# EAGLE design MLX81310EVB_BoardHolder (EAGLE 6.4)

## Sheet 1 of 2
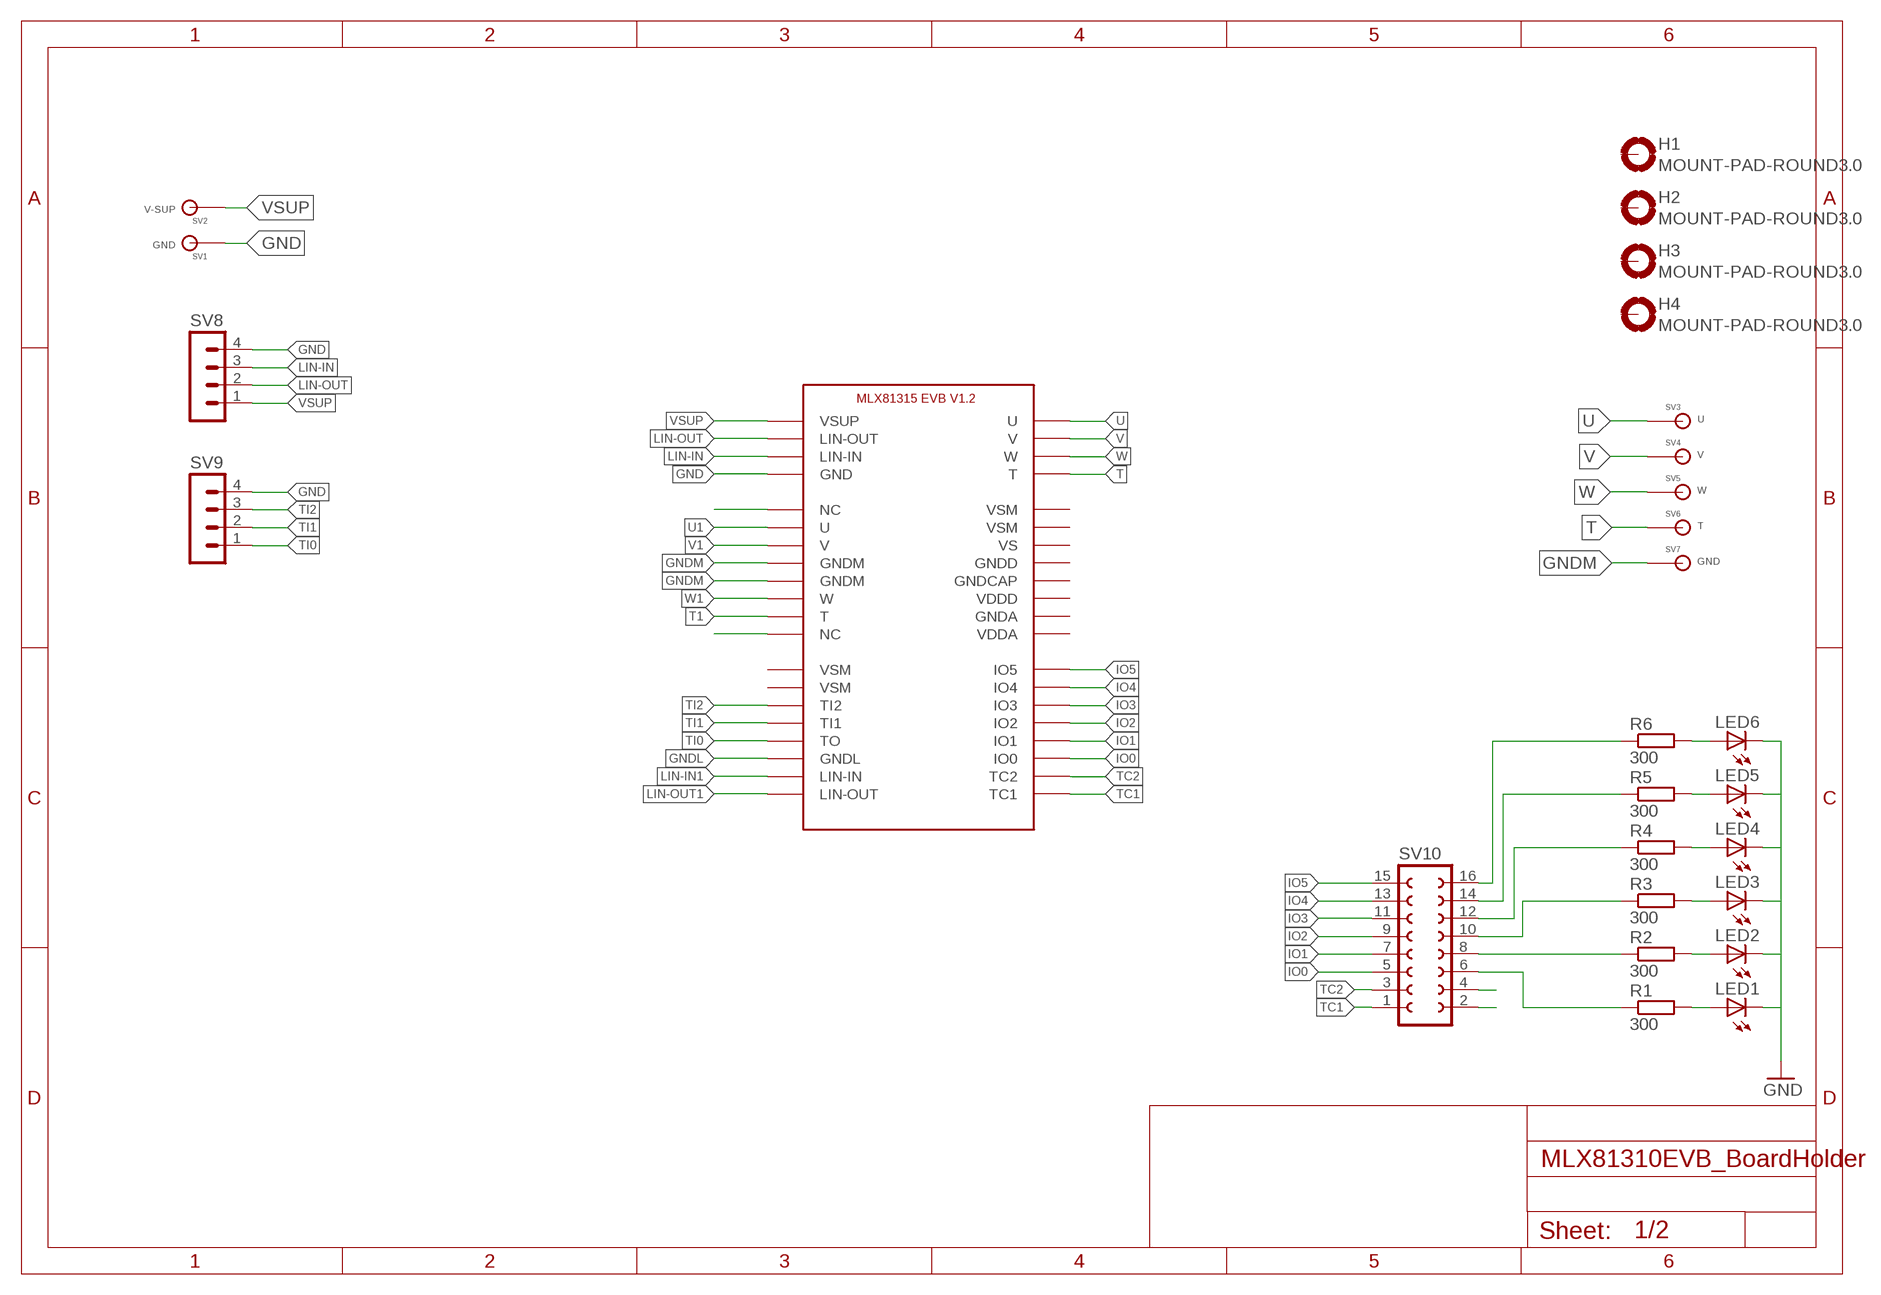
[diagram p0: schematic, sheet 1]

### Parts
B1  MLX91315_EVB  [MLX81315EVB]
H1  MOUNT-PAD-ROUND3.0  [3,0-PAD]
H2  MOUNT-PAD-ROUND3.0  [3,0-PAD]
H3  MOUNT-PAD-ROUND3.0  [3,0-PAD]
H4  MOUNT-PAD-ROUND3.0  [3,0-PAD]
LED1  LEDCHIPLED_0805  [CHIPLED_0805]
LED2  LEDCHIPLED_0805  [CHIPLED_0805]
LED3  LEDCHIPLED_0805  [CHIPLED_0805]
LED4  LEDCHIPLED_0805  [CHIPLED_0805]
LED5  LEDCHIPLED_0805  [CHIPLED_0805]
LED6  LEDCHIPLED_0805  [CHIPLED_0805]
R1  300  R-EU_M0805  [M0805]
R2  300  R-EU_M0805  [M0805]
R3  300  R-EU_M0805  [M0805]
R4  300  R-EU_M0805  [M0805]
R5  300  R-EU_M0805  [M0805]
R6  300  R-EU_M0805  [M0805]
SV1  GND  BANANNA_CONNECTOR_SOLDER_4MM  [BANANNA_CONNECTOR_SOLIDER_4MM]
SV2  V-SUP  BANANNA_CONNECTOR_SOLDER_4MM  [BANANNA_CONNECTOR_SOLIDER_4MM]
SV3  U  BANANNA_CONNECTOR_SOLDER_4MM  [BANANNA_CONNECTOR_SOLIDER_4MM]
SV4  V  BANANNA_CONNECTOR_SOLDER_4MM  [BANANNA_CONNECTOR_SOLIDER_4MM]
SV5  W  BANANNA_CONNECTOR_SOLDER_4MM  [BANANNA_CONNECTOR_SOLIDER_4MM]
SV6  T  BANANNA_CONNECTOR_SOLDER_4MM  [BANANNA_CONNECTOR_SOLIDER_4MM]
SV7  GND  BANANNA_CONNECTOR_SOLDER_4MM  [BANANNA_CONNECTOR_SOLIDER_4MM]
SV8  MA04-1  [MA04-1]
SV9  MA04-1  [MA04-1]
SV10  FE08-2  [FE08-2]

### Nets
GND: B1.GND@1(GND) LED1.C LED2.C LED3.C LED4.C LED5.C LED6.C SV1.P$1 SV8.4 SV9.4
GNDL: B1.GNDL
GNDM: B1.GNDM@1(GNDM) B1.GNDM@2(GNDM) SV7.P$1
IO0: B1.IO0 SV10.5
IO1: B1.IO1 SV10.7
IO2: B1.IO2 SV10.9
IO3: B1.IO3 SV10.11
IO4: B1.IO4 SV10.13
IO5: B1.IO5 SV10.15
LIN-IN: B1.LIN-IN@1(LIN-IN) SV8.3
LIN-IN1: B1.LIN-IN@2(LIN-IN)
LIN-OUT: B1.LIN-OUT@1(LIN-OUT) SV8.2
LIN-OUT1: B1.LIN-OUT@2(LIN-OUT)
N$1: R6.1 SV10.16
N$2: R4.1 SV10.12
N$3: R1.1 SV10.6
N$4: R2.1 SV10.8
N$5: LED1.A R1.2
N$6: R3.1 SV10.10
N$7: R5.1 SV10.14
N$8: LED6.A R6.2
N$9: LED5.A R5.2
N$10: LED4.A R4.2
N$11: B1.NC$1(NC)
N$12: LED3.A R3.2
N$13: LED2.A R2.2
N$18: B1.NC@8(NC)
T: B1.T@1(T) SV6.P$1
T1: B1.T@2(T)
TC1: B1.TC1 SV10.1 SV10.2
TC2: B1.TC2 SV10.3 SV10.4
TI0: B1.T0(TO) SV9.1
TI1: B1.TI1 SV9.2
TI2: B1.TI2 SV9.3
U: B1.U@1(U) SV3.P$1
U1: B1.U@2(U)
V: B1.V@1(V) SV4.P$1
V1: B1.V@2(V)
VSUP: B1.VSUP SV2.P$1 SV8.1
W: B1.W@1(W) SV5.P$1
W1: B1.W@2(W)
Unconnected: B1.GNDA B1.GNDCAP B1.GNDD B1.VDDA B1.VDDD B1.VS B1.VSM$1(VSM) B1.VSM$2(VSM) B1.VSM@1(VSM) B1.VSM@2(VSM) H1.B3,0(MOUNT) H2.B3,0(MOUNT) H3.B3,0(MOUNT) H4.B3,0(MOUNT)

## Sheet 2 of 2
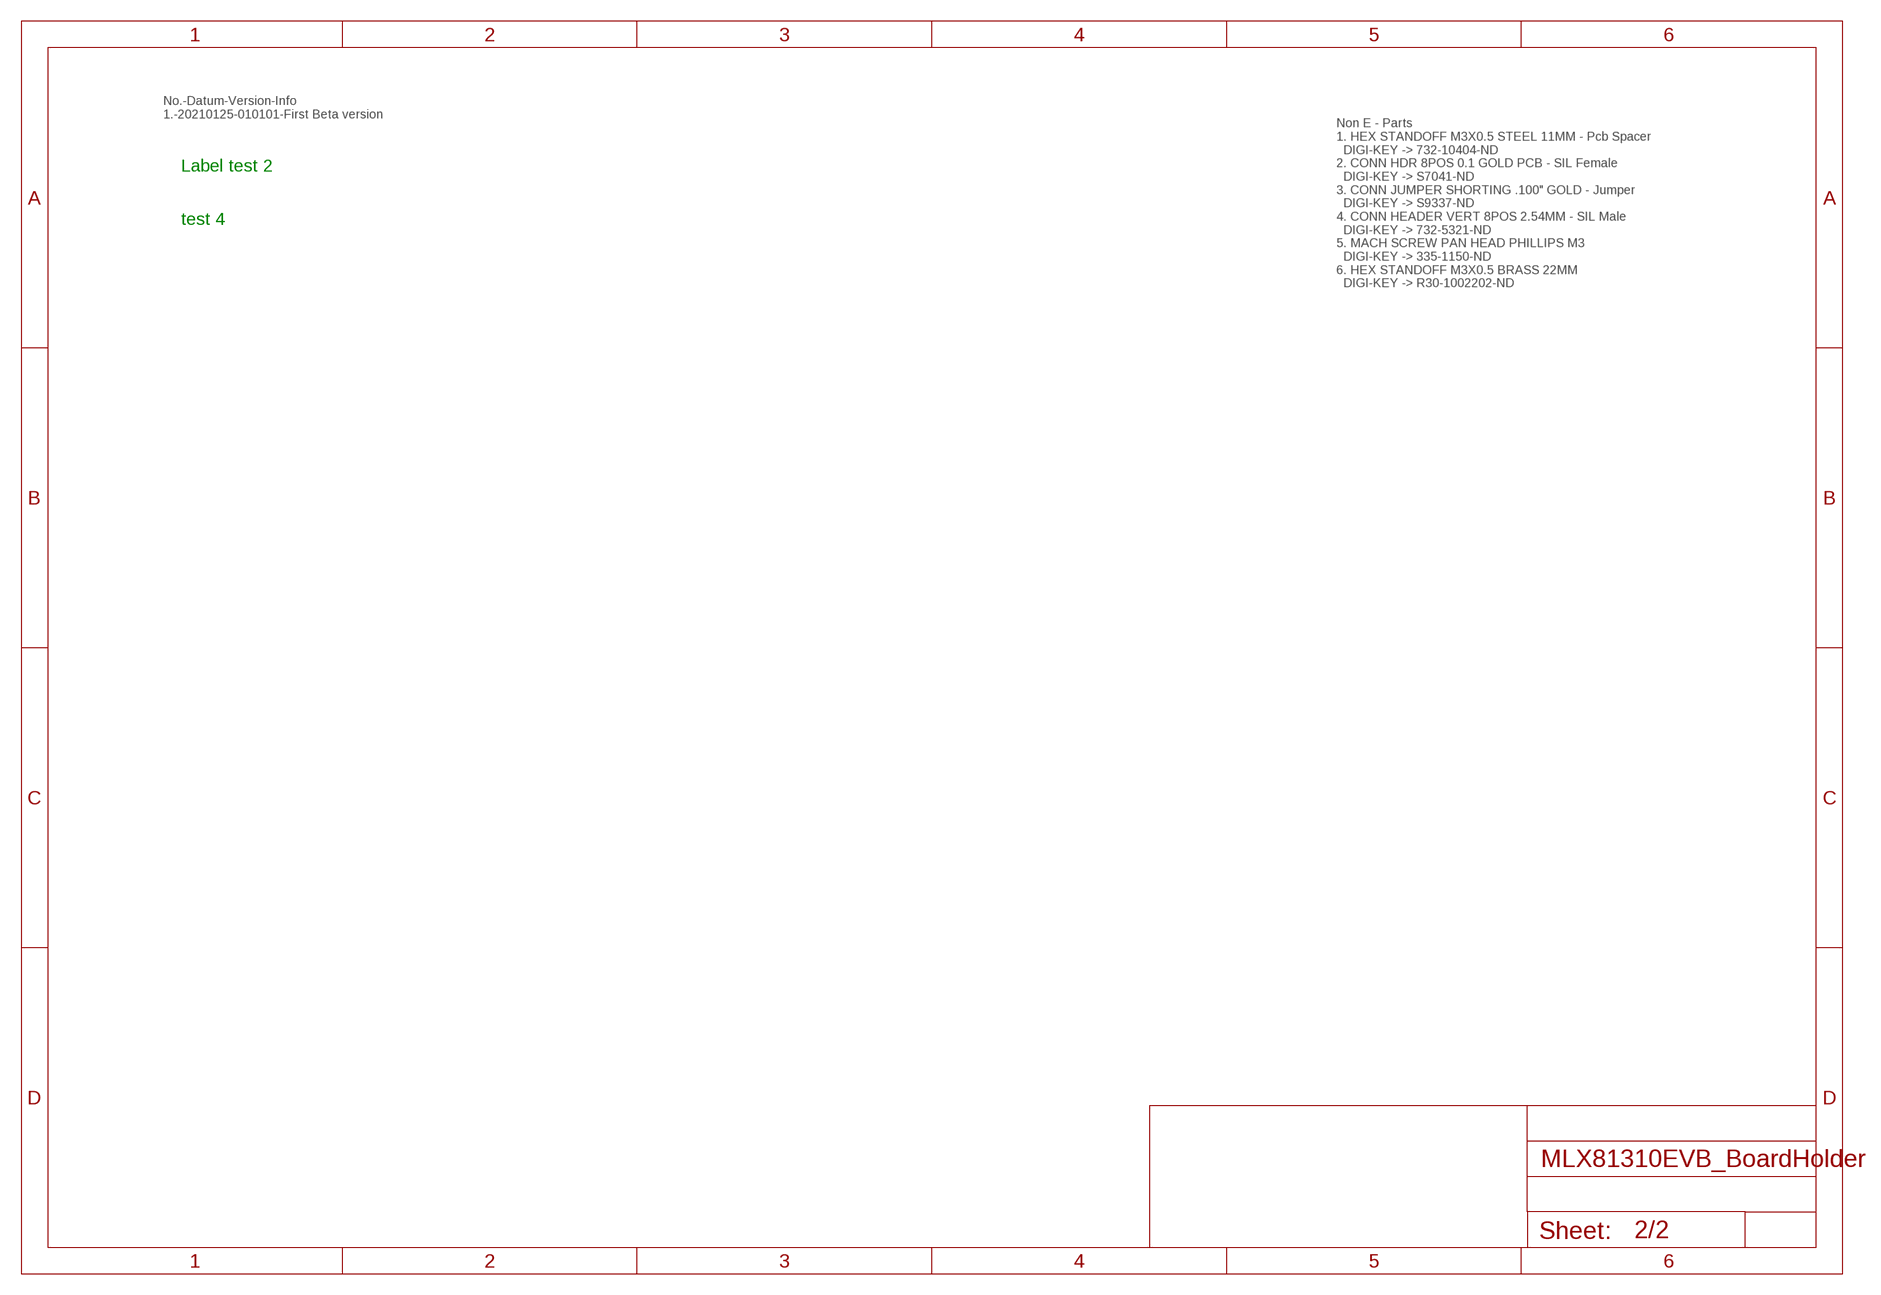
[diagram p1: schematic, sheet 2]

### Notes on the sheet
- No.-Datum-Version-Info	
  1.-20210125-010101-First Beta version
- Non E - Parts 
  1. HEX STANDOFF M3X0.5 STEEL 11MM - Pcb Spacer
    DIGI-KEY -> 732-10404-ND
  2. CONN HDR 8POS 0.1 GOLD PCB - SIL Female
    DIGI-KEY -> S7041-ND
  3. CONN JUMPER SHORTING .100" GOLD - Jumper
    DIGI-KEY -> S9337-ND
  4. CONN HEADER VERT 8POS 2.54MM - SIL Male
    DIGI-KEY -> 732-5321-ND
  5. MACH SCREW PAN HEAD PHILLIPS M3
    DIGI-KEY -> 335-1150-ND
  6. HEX STANDOFF M3X0.5 BRASS 22MM
    DIGI-KEY -> R30-1002202-ND
- Label test 2
- test 4

## Library data of the parts
B1 = MLX81315EVB:MLX91315_EVB: MLX81310EVB_V1.3
H1-H4 = holes:MOUNT-PAD-ROUND: MOUNTING PAD, round
LED1-LED6 = led:LED: LED OSRAM: - CHIPLED LG R971, LG N971, LY N971, LG Q971, LY Q971, LO R971, LY R971 LH N974, LH R974 LS Q976, LO Q976, LY Q976 LO Q996 - Hyper CHIPLED LW Q18S LB Q993, LB Q99A, LB R99A - SideLED LS A670, LO A670, LY A670, LG A670, LP A670 LB A673, LV A673, LT A673, LW A673 LH A674 LY A675 LS A676, LA A676, LO A676, LY A676, LW A676 LS A679, LY A679, LG A679 - Hyper Micro SIDELED® LS Y876, LA Y876, LO Y876, LY Y876 LT Y87S - SmartLED LW L88C, LW L88S LB L89C, LB L89S, LG L890 LS L89K, LO L89K, LY L89K LS L896, LA L896, LO L896, LY L896 - TOPLED LS T670, LO T670, LY T670, LG T670, LP T670 LSG T670, LSP T670, LSY T670, LOP T670, LYG T670 LG T671, LOG T671, LSG T671 LB T673, LV T673, LT T673, LW T673 LH T674 LS T676, LA T676, LO T676, LY T676, LB T676, LH T676, LSB T676, LW T676 LB T67C, LV T67C, LT T67C, LS T67K, LO T67K, LY T67K, LW E67C LS E67B, LA E67B, LO E67B, LY E67B, LB E67C, LV E67C, LT E67C LW T67C LS T679, LY T679, LG T679 LS T770, LO T770, LY T770, LG T770, LP T770 LB T773, LV T773, LT T773, LW T773 LH T774 LS E675, LA E675, LY E675, LS T675 LS T776, LA T776, LO T776, LY T776, LB T776 LHGB T686 LT T68C, LB T68C - Hyper Mini TOPLED® LB M676 - Mini TOPLED Santana® LG M470 LS M47K, LO M47K, LY M47K Source: http://www.osram.convergy.de LUXEON: - LUMILED® LXK2-PW12-R00, LXK2-PW12-S00, LXK2-PW14-U00, LXK2-PW14-V00 LXK2-PM12-R00, LXK2-PM12-S00, LXK2-PM14-U00 LXK2-PE12-Q00, LXK2-PE12-R00, LXK2-PE12-S00, LXK2-PE14-T00, LXK2-PE14-U00 LXK2-PB12-K00, LXK2-PB12-L00, LXK2-PB12-M00, LXK2-PB14-N00, LXK2-PB14-P00, LXK2-PB14-Q00 LXK2-PR12-L00, LXK2-PR12-M00, LXK2-PR14-Q00, LXK2-PR14-R00 LXK2-PD12-Q00, LXK2-PD12-R00, LXK2-PD12-S00 LXK2-PH12-R00, LXK2-PH12-S00 LXK2-PL12-P00, LXK2-PL12-Q00, LXK2-PL12-R00 Source: www.luxeon.com KINGBRIGHT: KA-3528ASYC Source: www.kingbright.com; DIGI-KEY: 160-1218-1-ND
R1-R6 = resistor:R-EU_: RESISTOR, European symbol; DIGI-KEY: RR12P300DCT-ND
SV1-SV7 = EagleLib:BANANNA_CONNECTOR_SOLDER_4MM: Bananensteckerbuchse Connector Standard-Bananenstecker Lötverbindung; DIGI-KEY: 36-575-4-ND
SV8 SV9 = con-lstb:MA04-1: PIN HEADER; DIGI-KEY: 732-5317-ND; OC_FARNELL: unknown; OC_NEWARK: unknown
SV10 = con-lsta:FE08-2: FEMALE HEADER; DIGI-KEY: 609-3364-ND; OC_FARNELL: unknown; OC_NEWARK: unknown

## Board
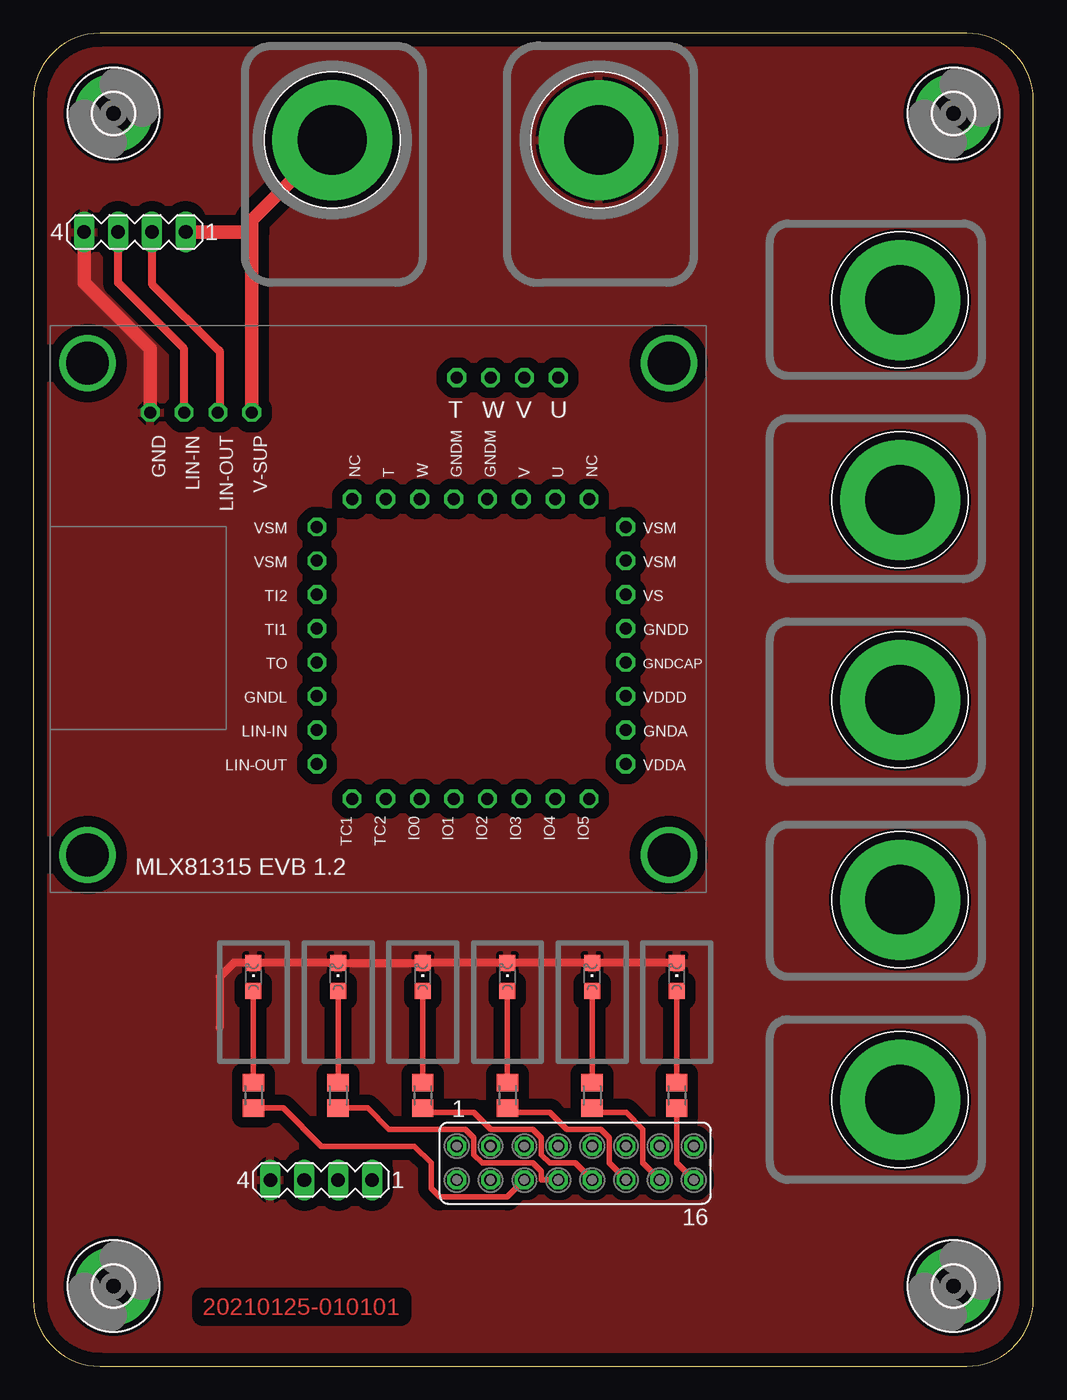
[diagram p2: board, top side]
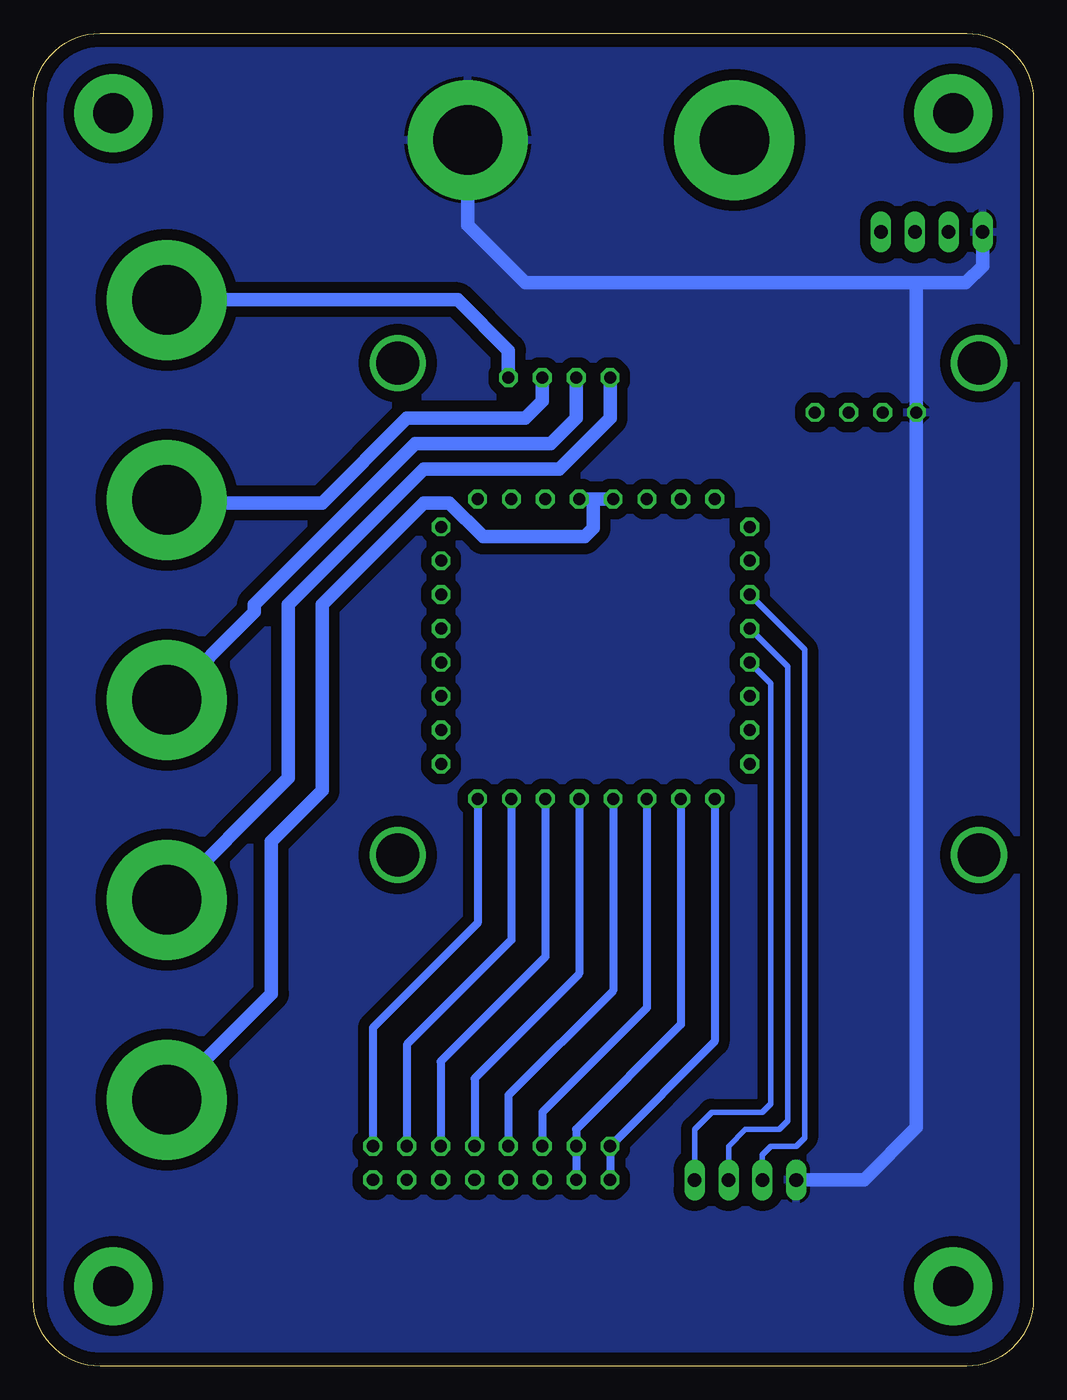
[diagram p3: board, bottom side, seen from below]

Size 75 x 100 mm. Coordinates in mm from the lower left corner, seen from the top.
Outline: 0,95 0,5 arc90 5,0 70,0 arc90 75,5 75,95 arc90 70,100 5,100 arc90 0,95
Copper layers (1*16): Top 0.035mm / dielectric 1.5mm / Bottom 0.035mm
Design rules "default": minimum track width 10mil, minimum drill 24mil, track to track 8mil, track to pad 8mil, pad to pad 8mil, via to via 8mil, smd to smd 8mil, copper to edge 40mil, drill to drill 8mil, minimum pad ring 10mil, minimum via ring 8mil, stop-mask expansion 4mil, vias tented up to drill 0mil, thermal gap 10mil

### Footprints (pad centres in the part's own frame; a part is rotated, then mirrored left to right if it is on the bottom)
MLX81315EVB = drill 0.9 octagon: GND@1 7.493,36; GNDA 43.155,12.167; GNDCAP 43.155,17.247; GNDD 43.155,19.787; GNDL 20,14.707; GNDM@1 32.791,29.5; GNDM@2 30.251,29.5; IO0 27.711,7.01; IO1 30.251,7.01; IO2 32.791,7.01; IO3 35.331,7.01; IO4 37.871,7.01; IO5 40.411,7.01; LIN-IN@1 10.033,36; LIN-IN@2 20,12.167; LIN-OUT@1 12.573,36; LIN-OUT@2 20,9.627; NC$1 40.411,29.5; NC@8 22.631,29.5; T0 20,17.247; T@1 30.48,38.608; T@2 25.171,29.5; TC1 22.631,7.01; TC2 25.171,7.01; TI1 20,19.787; TI2 20,22.327; U@1 38.1,38.608; U@2 37.871,29.5; V@1 35.56,38.608; V@2 35.331,29.5; VDDA 43.155,9.627; VDDD 43.155,14.707; VS 43.155,22.327; VSM$1 20,27.407; VSM$2 20,24.867; VSM@1 43.155,24.867; VSM@2 43.155,27.407; VSUP 15.113,36; W@1 33.02,38.608; W@2 27.711,29.5 | drill 3.2: P$1 2.8,2.8; P$2 46.4,2.8; P$3 46.4,39.7; P$4 2.8,39.7
3,0-PAD = drill 3 pad 5.842: B3,0 0,0
CHIPLED_0805 = smd 1.2 x 1.2: A 0,-1.05; C 0,1.05
M0805 = smd 1.3 x 1.6: 1 -0.95,0; 2 0.95,0
BANANNA_CONNECTOR_SOLIDER_4MM = drill 5.2 pad 9: P$1 0,0
MA04-1 = drill 1.016 long: 1 -3.81,0; 2 -1.27,0; 3 1.27,0; 4 3.81,0
FE08-2 = drill 0.914 octagon: 1 -8.89,1.27; 2 -8.89,-1.27; 3 -6.35,1.27; 4 -6.35,-1.27; 5 -3.81,1.27; 6 -3.81,-1.27; 7 -1.27,1.27; 8 -1.27,-1.27; 9 1.27,1.27; 10 1.27,-1.27; 11 3.81,1.27; 12 3.81,-1.27; 13 6.35,1.27; 14 6.35,-1.27; 15 8.89,1.27; 16 8.89,-1.27

### Placement (x,y rotation side)
B1  1.27,35.56 0 top
H1  69,6 0 top
H2  69,94 0 top
H3  6,6 0 top
H4  6,94 0 top
LED1  16.51,29.21 0 top
LED2  22.86,29.21 0 top
LED3  29.21,29.21 0 top
LED4  35.56,29.21 0 top
LED5  41.91,29.21 0 top
LED6  48.26,29.21 0 top
R1  16.51,20.32 90 top
R2  22.86,20.32 90 top
R3  29.21,20.32 90 top
R4  35.56,20.32 90 top
R5  41.91,20.32 90 top
R6  48.26,20.32 90 top
SV1  42.42,92 0 top
SV2  22.42,92 0 top
SV3  65,80 0 top
SV4  65,65 0 top
SV5  65,50 0 top
SV6  65,35 0 top
SV7  65,20 0 top
SV8  7.62,85.09 180 top
SV9  21.59,13.97 180 top
SV10  40.64,15.24 0 top

### Tracks (layer width: path | path; a pad name or v marks a point on that pad's centre or on a via)
GND
  Top 0.61: LED6.C LED5.C LED4.C LED3.C LED2.C LED1.C 15.02,30.26 13.97,29.21 13.97,25.4
  Top 1.016: B1.GND@1 8.76,76.33 3.81,81.28 SV8.4
  Bottom 1.016: SV1.P$1 42.42,85.6 38.1,81.28 8.89,81.28 | 8.89,81.28 5.08,81.28 3.81,82.55 SV8.4 | 8.89,81.28 8.76,81.15 B1.GND@1 8.76,17.91 12.7,13.97 SV9.4
  pour Bottom (isolate 0.813): 0,0 74.93,0 74.93,92.71 74.93,100.33 10.16,100.33 0,100.33
  pour Top (isolate 0.813): 0,0 74.93,0 74.93,100.33 0,100.33
GNDM
  Bottom 1.016: SV7.P$1 65,20.09 57.15,27.94 57.15,39.37 53.34,43.18 53.34,57.15 45.72,64.77 43.81,64.77 41.27,62.23 33.66,62.23 33.02,62.87 33.02,65.06 | B1.GNDM@1 33.02,65.06 | 33.02,65.06 B1.GNDM@2
IO0
  Bottom 0.61: B1.IO0 28.98,26.9 36.83,19.05 SV10.5
IO1
  Bottom 0.61: B1.IO1 31.52,28.17 39.37,20.32 SV10.7
IO2
  Bottom 0.61: B1.IO2 34.06,29.44 41.91,21.59 SV10.9
IO3
  Bottom 0.61: B1.IO3 36.6,30.71 44.45,22.86 SV10.11
IO4
  Bottom 0.61: B1.IO4 39.14,31.98 46.99,24.13 SV10.13
IO5
  Bottom 0.61: B1.IO5 41.68,33.25 49.53,25.4 SV10.15
LIN-IN
  Top 0.61: B1.LIN-IN@1 11.3,76.33 6.35,81.28 SV8.3
LIN-OUT
  Top 0.61: SV8.2 8.89,81.2 13.89,76.2 13.97,76.2 13.97,71.69 B1.LIN-OUT@1
N$1
  Top 0.406: SV10.16 48.26,15.24 R6.1
N$2
  Top 0.406: R4.1 35.88,19.05 38.73,19.05 40.01,17.78 42.55,17.78 43.18,17.14 43.18,15.24 SV10.12
N$3
  Top 0.406: R1.1 18.73,19.37 21.59,16.51 28.57,16.51 29.84,15.24 29.84,13.34 30.48,12.7 35.56,12.7 SV10.6
N$4
  Top 0.406: R2.1 25.08,19.37 26.67,17.78 32.38,17.78 33.02,17.14 33.02,15.88 33.66,15.24 37.47,15.24 38.1,14.61 38.1,13.97 SV10.8
N$5
  Top 0.406: R1.2 LED1.A
N$6
  Top 0.406: SV10.10 40.64,15.24 38.73,15.24 38.1,15.88 38.1,17.14 37.47,17.78 34.29,17.78 33.02,19.05 29.53,19.05 R3.1
N$7
  Top 0.406: SV10.14 45.72,15.24 45.72,17.78 44.45,19.05 42.23,19.05 R5.1
N$8
  Top 0.406: R6.2 LED6.A
N$9
  Top 0.406: R5.2 LED5.A
N$10
  Top 0.406: R4.2 LED4.A
N$12
  Top 0.406: R3.2 LED3.A
N$13
  Top 0.406: R2.2 LED2.A
T
  Bottom 1.016: B1.T@1 31.75,71.12 35.56,67.31 45.72,67.31 55.88,57.15 55.88,44.12 SV6.P$1
TC1
  Bottom 0.61: B1.TC1 23.9,24.36 SV10.1 SV10.2
TC2
  Bottom 0.61: B1.TC2 26.44,25.63 34.29,17.78 SV10.3 SV10.4
TI0
  Bottom 0.406: B1.T0 19.68,51.22 19.68,19.68 20.32,19.05 24.13,19.05 25.4,17.78 SV9.1
TI1
  Bottom 0.406: B1.TI1 18.41,52.49 18.41,18.41 19.05,17.78 21.59,17.78 22.86,16.51 SV9.2
TI2
  Bottom 0.406: 21.06,57.89 B1.TI2 17.14,53.76 17.14,17.14 17.78,16.51 19.68,16.51 20.32,15.88 SV9.3
U
  Bottom 1.016: B1.U@1 39.37,76.2 43.18,80.01 SV3.P$1
V
  Bottom 1.016: B1.V@1 36.83,72.39 38.1,71.12 46.99,71.12 53.34,64.77 64.77,64.77 SV4.P$1
VSUP
  Top 1.016: B1.VSUP 16.38,85.09 | 16.38,85.09 16.38,85.96 SV2.P$1 | SV8.1 16.38,85.09
W
  Bottom 1.016: B1.W@1 34.29,71.12 36.2,69.22 46.35,69.22 58.42,57.15 58.42,56.58 SV5.P$1

### Text on the board
Top: 20210125-010101
tDocu: GND | LIN-IN | LIN-O | V-SUP | IO0 | IO1 | IO2 | IO3 | IO4 | IO5 | GND | TI2 | TI1 | TI0 | TC1 | TC2 | IO0 | IO1 | IO2 | IO3 | IO4 | IO5